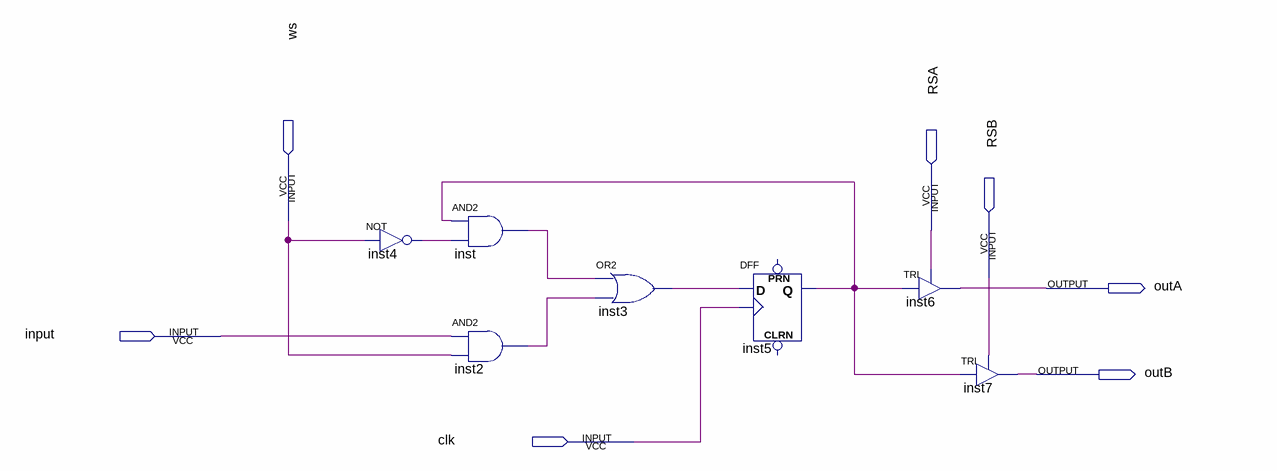
[diagram p0: schematic sheet]
// Quartus schematic RFC.bdf as structural Verilog: 7 symbols, 7 pins
module RFC (
  input  ws,
  input  RSA,
  input  RSB,
  input  \input ,
  input  clk,
  output outA,
  output outB
);

  wire inst2_out, inst3_out, inst4_out, inst5_q, inst_out;

  not inst4 (inst4_out, ws);
  and inst (inst_out, inst5_q, inst4_out);
  and inst2 (inst2_out, \input , ws);
  or inst3 (inst3_out, inst_out, inst2_out);
  DFF inst5 (.CLK(clk), .D(inst3_out), .Q(inst5_q));  // open: CLRN, PRN
  TRI inst6 (.IN(inst5_q), .OE(RSA), .OUT(outA));
  TRI inst7 (.IN(inst5_q), .OE(RSB), .OUT(outB));
endmodule
